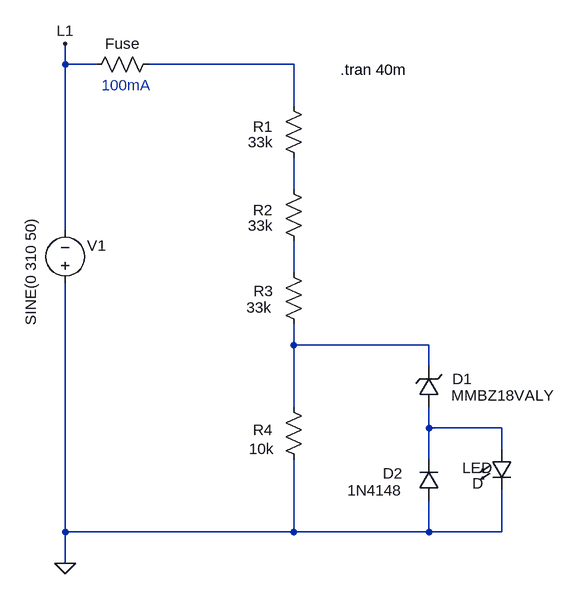
[diagram p0: schematic v1.2.asc]
v1.2.asc, the LTspice schematic file:
Version 4.1
SHEET 1 1084 836
WIRE -144 16 -144 -16
WIRE -96 16 -144 16
WIRE 208 16 -16 16
WIRE 208 80 208 16
WIRE 208 208 208 160
WIRE -144 272 -144 16
WIRE 208 336 208 288
WIRE 208 448 208 416
WIRE 416 448 208 448
WIRE 416 480 416 448
WIRE 208 544 208 448
WIRE 416 576 416 544
WIRE 528 576 416 576
WIRE 528 608 528 576
WIRE 416 624 416 576
WIRE -144 736 -144 352
WIRE 208 736 208 624
WIRE 208 736 -144 736
WIRE 416 736 416 688
WIRE 416 736 208 736
WIRE 528 736 528 672
WIRE 528 736 416 736
WIRE -144 784 -144 736
FLAG -144 784 0
FLAG -144 -16 L1
SYMBOL voltage -144 368 R180
WINDOW 123 0 0 Left 0
WINDOW 39 0 0 Left 0
WINDOW 0 -63 73 Left 2
WINDOW 3 53 -50 VRight 2
SYMATTR InstName V1
SYMATTR Value SINE(0 310 50)
SYMBOL res 224 176 R180
WINDOW 0 48 64 Left 2
WINDOW 3 48 40 Left 2
SYMATTR InstName R1
SYMATTR Value 33k
SYMBOL res 224 304 R180
WINDOW 0 48 64 Left 2
WINDOW 3 48 40 Left 2
SYMATTR InstName R2
SYMATTR Value 33k
SYMBOL res 192 528 R0
WINDOW 0 -47 51 Left 2
WINDOW 3 -53 80 Left 2
SYMATTR InstName R4
SYMATTR Value 10k
SYMBOL res 192 320 R0
WINDOW 0 -46 45 Left 2
WINDOW 3 -57 70 Left 2
SYMATTR InstName R3
SYMATTR Value 33k
SYMBOL zener 432 544 R180
WINDOW 0 -51 44 Left 2
WINDOW 3 -177 18 Left 2
SYMATTR InstName D1
SYMATTR Value MMBZ18VALY
SYMBOL diode 432 688 R180
WINDOW 0 56 42 Left 2
WINDOW 3 57 16 Left 2
SYMATTR InstName D2
SYMATTR Value 1N4148
SYMBOL LED 512 608 R0
WINDOW 0 -45 29 Left 2
WINDOW 3 -29 53 Left 2
SYMATTR InstName LED
SYMBOL res 0 0 R90
WINDOW 0 0 56 VBottom 2
WINDOW 3 32 56 Invisible 2
SYMATTR InstName Fuse
SYMATTR Value 0
TEXT 280 24 Left 2 !.tran 40m
TEXT -88 48 Left 2 ;100mA

The netlist it stands for:
* v1.2.asc
V1 0 L1 SINE(0 310 50)
R1 N002 N001 33k
R2 N003 N002 33k
R4 N004 0 10k
R3 N003 N004 33k
D1 N005 N004 MMBZ18VALY
D2 0 N005 1N4148
D§LED N005 0 D
R§Fuse N001 L1 0
.model D D
.lib standard.dio
.tran 40m
* 100mA
.backanno
.end